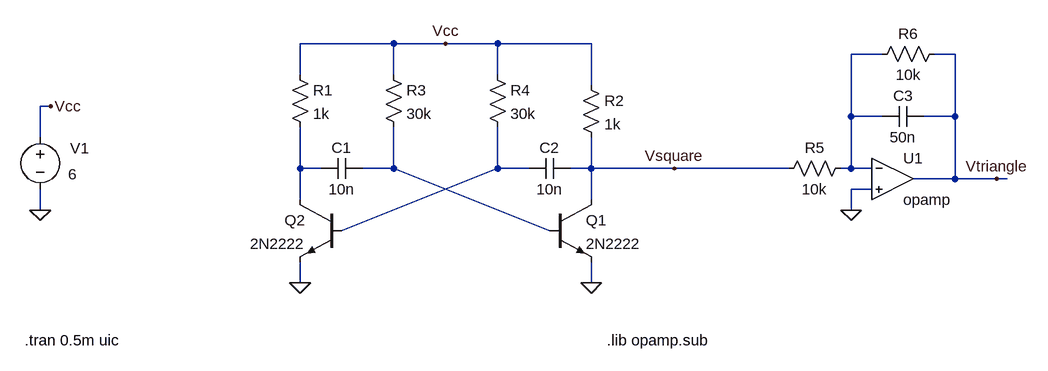
[diagram p0: schematic Proiect1.asc]
Proiect1.asc, the LTspice schematic file:
Version 4
SHEET 1 1448 680
WIRE 32 -160 -112 -160
WIRE 112 -160 32 -160
WIRE 192 -160 112 -160
WIRE 336 -160 192 -160
WIRE 784 -144 736 -144
WIRE 896 -144 864 -144
WIRE -112 -112 -112 -160
WIRE 32 -112 32 -160
WIRE 192 -112 192 -160
WIRE 336 -96 336 -160
WIRE -496 -64 -512 -64
WIRE 736 -48 736 -144
WIRE 784 -48 736 -48
WIRE 896 -48 896 -144
WIRE 896 -48 848 -48
WIRE -512 -16 -512 -64
WIRE -112 32 -112 -32
WIRE -80 32 -112 32
WIRE 32 32 32 -32
WIRE 32 32 -16 32
WIRE 192 32 192 -32
WIRE 240 32 192 32
WIRE 336 32 336 -16
WIRE 336 32 304 32
WIRE 464 32 336 32
WIRE 640 32 464 32
WIRE 736 32 736 -48
WIRE 736 32 720 32
WIRE 768 32 736 32
WIRE 896 48 896 -48
WIRE 896 48 832 48
WIRE 960 48 896 48
WIRE 976 48 960 48
WIRE 768 64 736 64
WIRE -112 80 -112 32
WIRE 336 80 336 32
WIRE -512 96 -512 64
WIRE 736 96 736 64
WIRE -48 128 192 32
WIRE 272 128 32 32
WIRE -112 208 -112 176
WIRE 336 208 336 176
FLAG -496 -64 Vcc
FLAG 112 -160 Vcc
FLAG 464 32 Vsquare
FLAG -512 96 0
FLAG -112 208 0
FLAG 336 208 0
FLAG 736 96 0
FLAG 960 48 Vtriangle
SYMBOL npn 272 80 R0
SYMATTR InstName Q1
SYMATTR Value 2N2222
SYMBOL npn -48 80 M0
SYMATTR InstName Q2
SYMATTR Value 2N2222
SYMBOL res -128 -128 R0
SYMATTR InstName R1
SYMATTR Value 1k
SYMBOL res 320 -112 R0
SYMATTR InstName R2
SYMATTR Value 1k
SYMBOL cap -16 16 R90
WINDOW 0 0 32 VBottom 2
WINDOW 3 32 32 VTop 2
SYMATTR InstName C1
SYMATTR Value 10n
SYMBOL cap 304 16 R90
WINDOW 0 0 32 VBottom 2
WINDOW 3 32 32 VTop 2
SYMATTR InstName C2
SYMATTR Value 10n
SYMBOL res 16 -128 R0
SYMATTR InstName R3
SYMATTR Value 30k
SYMBOL res 176 -128 R0
SYMATTR InstName R4
SYMATTR Value 30k
SYMBOL voltage -512 -32 R0
WINDOW 0 46 33 Left 2
WINDOW 3 43 73 Left 2
WINDOW 123 0 0 Left 0
WINDOW 39 0 0 Left 0
SYMATTR InstName V1
SYMATTR Value 6
SYMBOL OpAmps\\opamp 800 -16 R0
SYMATTR InstName U1
SYMBOL res 736 16 R90
WINDOW 0 0 56 VBottom 2
WINDOW 3 32 56 VTop 2
SYMATTR InstName R5
SYMATTR Value 10k
SYMBOL cap 848 -64 R90
WINDOW 0 0 32 VBottom 2
WINDOW 3 32 32 VTop 2
SYMATTR InstName C3
SYMATTR Value 50n
SYMBOL res 880 -160 R90
WINDOW 0 0 56 VBottom 2
WINDOW 3 32 56 VTop 2
SYMATTR InstName R6
SYMATTR Value 10k
TEXT -536 296 Left 2 !.tran 0.5m uic
TEXT 360 296 Left 2 !.lib opamp.sub

The netlist it stands for:
* Proiect1.asc
Q1 Vsquare N003 0 0 2N2222
Q2 N002 N004 0 0 2N2222
R1 Vcc N002 1k
R2 Vcc Vsquare 1k
C1 N003 N002 10n
C2 Vsquare N004 10n
R3 Vcc N003 30k
R4 Vcc N004 30k
V1 Vcc 0 6
XU1 N001 0 Vtriangle opamp Aol=100K GBW=10Meg  ; pins invin noninvin out
R5 N001 Vsquare 10k
C3 Vtriangle N001 50n
R6 Vtriangle N001 10k
.model NPN NPN
.model PNP PNP
.lib standard.bjt
.tran 0.5m uic
.lib opamp.sub
.backanno
.end